# EAGLE board BlankMSXCartHSH (EAGLE 7.5.0), part 1 of 2
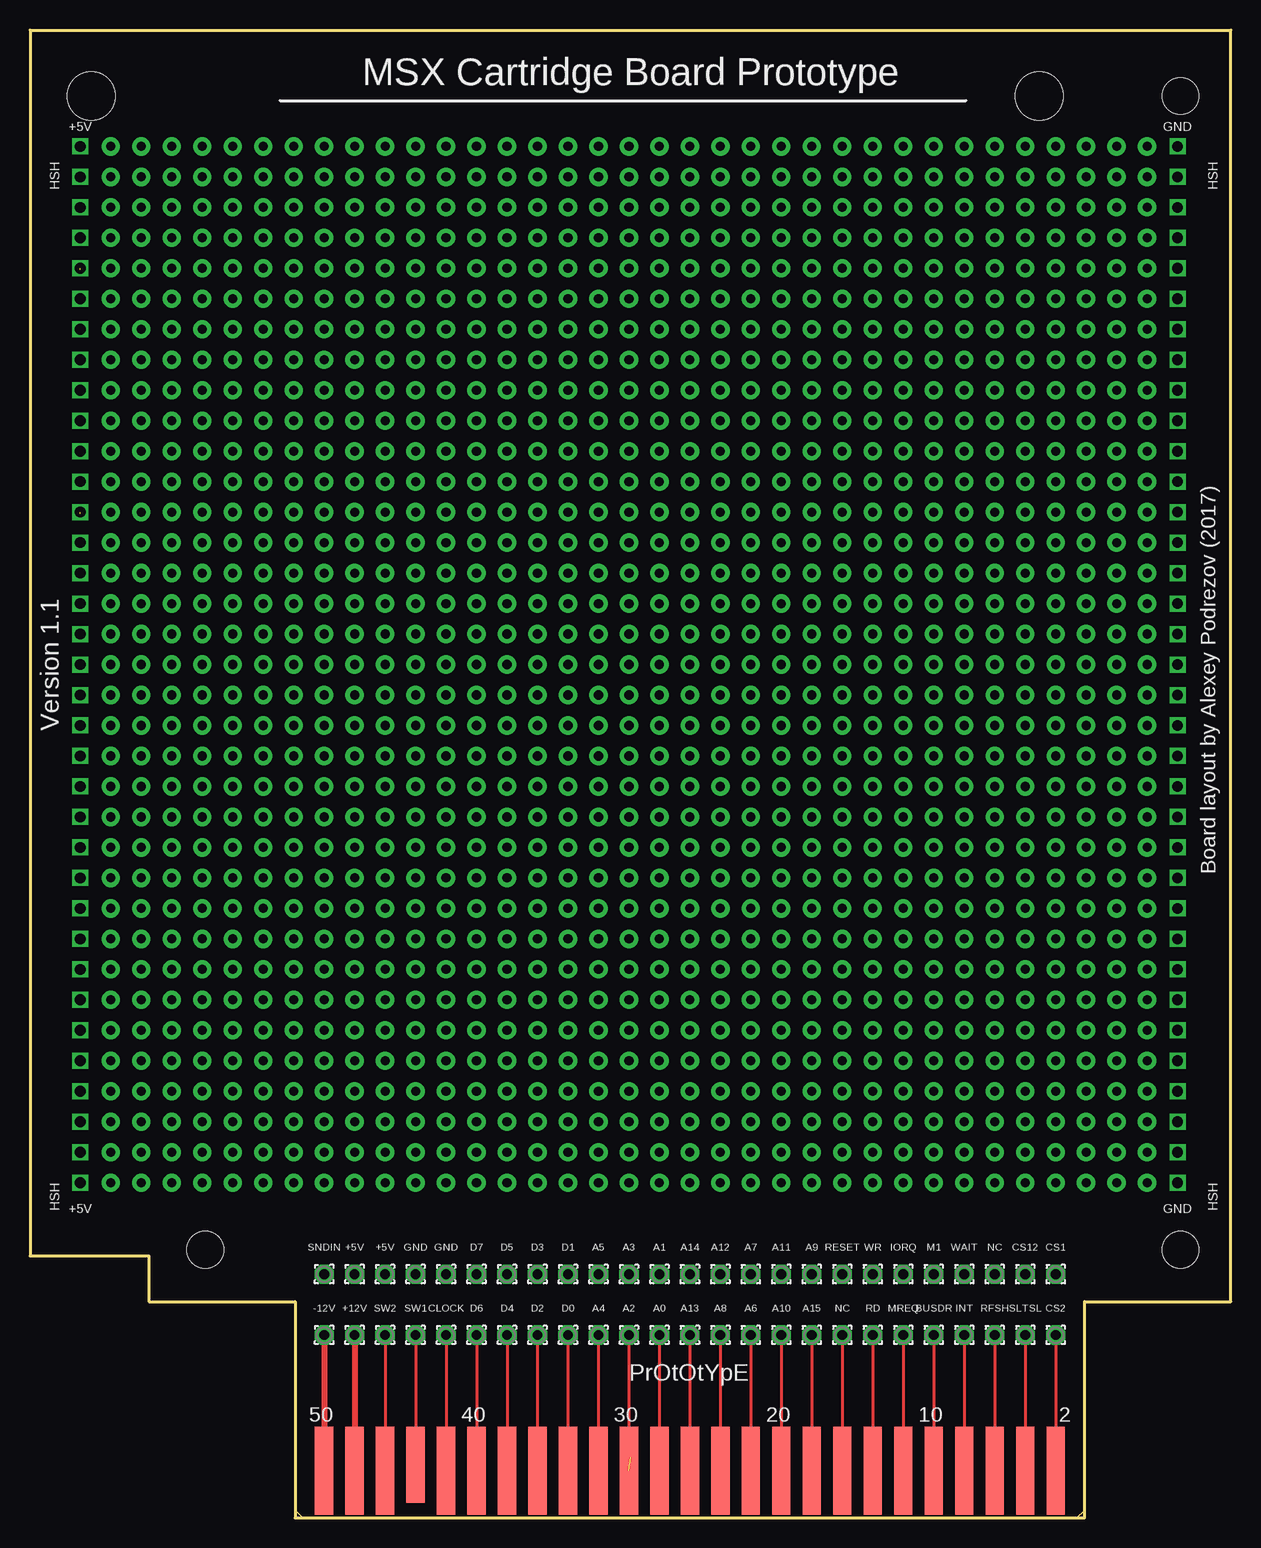
[diagram p1: board, top side]
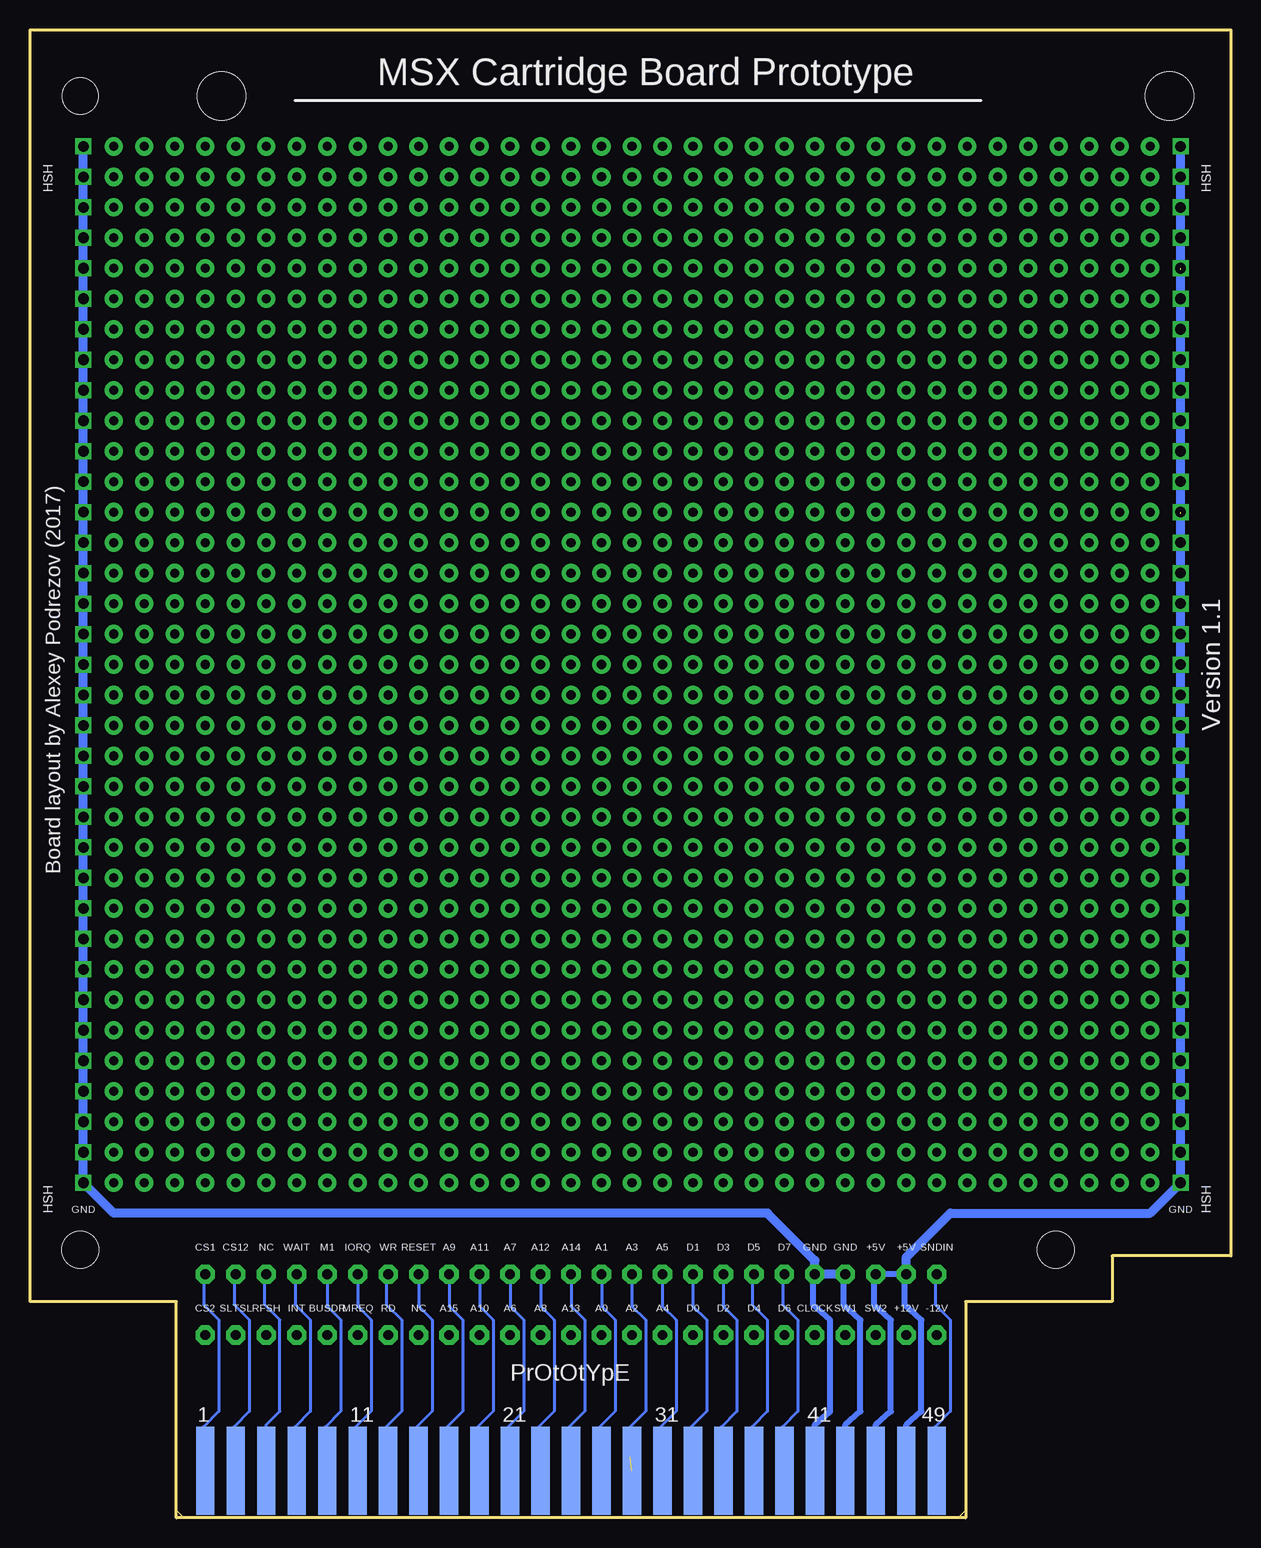
[diagram p2: board, bottom side, seen from below]

Size 100.08 x 124 mm. Coordinates in mm from the lower left corner, seen from the top.
Outline: 87.88,18.03 100.08,18.03 100.08,124 0,124 0,21.84 9.91,21.84 9.91,18.03 22.1,18.03
Outline: 22.1,18.03 22.1,12.95
Outline: 87.88,18.03 87.88,12.95
Outline: 22.1,18.03 22.1,0 87.88,0 87.88,18.03
Copper layers (1*16): Top 0.035mm / dielectric 1.5mm / Bottom 0.035mm
Design rules "default *": minimum track width 10mil, minimum drill 24mil, track to track 8mil, track to pad 8mil, pad to pad 8mil, via to via 8mil, smd to smd 8mil, copper to edge 10mil, drill to drill 8mil, minimum pad ring 10mil, minimum via ring 8mil, stop-mask expansion 4mil, vias tented up to drill 0mil, thermal gap 20mil
Holes 3.05 mm at 14.6,22.36 95.88,22.36
Holes 4 mm at 84.11,118.5 5.11,118.5
Holes 3 mm at 95.88,118.5

## Footprints (pad centres in the part's own frame; a part is rotated, then mirrored left to right if it is on the bottom)
MSXBUS_EDGECONN = smd 1.524 x 7.366 bottom: 1 30.48,3.937; 3 27.94,3.937; 5 25.4,3.937; 7 22.86,3.937; 9 20.32,3.937; 11 17.78,3.937; 13 15.24,3.937; 15 12.7,3.937; 17 10.16,3.937; 19 7.62,3.937; 21 5.08,3.937; 23 2.54,3.937; 25 0,3.937; 27 -2.54,3.937; 29 -5.08,3.937; 31 -7.62,3.937; 33 -10.16,3.937; 35 -12.7,3.937; 37 -15.24,3.937; 39 -17.78,3.937; 41 -20.32,3.937; 43 -22.86,3.937; 45 -25.4,3.937; 47 -27.94,3.937; 49 -30.48,3.937 | smd 1.524 x 7.366: 2 30.48,3.937; 4 27.94,3.937; 6 25.4,3.937; 8 22.86,3.937; 10 20.32,3.937; 12 17.78,3.937; 14 15.24,3.937; 16 12.7,3.937; 18 10.16,3.937; 20 7.62,3.937; 22 5.08,3.937; 24 2.54,3.937; 26 0,3.937; 28 -2.54,3.937; 30 -5.08,3.937; 32 -7.62,3.937; 34 -10.16,3.937; 36 -12.7,3.937; 38 -15.24,3.937; 40 -17.78,3.937; 42 -20.32,3.937; 46 -25.4,3.937; 48 -27.94,3.937; 50 -30.48,3.937 | smd 1.524 x 6.35: 44 -22.86,4.445
1,6/0,8 = drill 0.813 pad 1.6 octagon: 1 0,0

## Placement (x,y rotation side)
CN1  MSXBUS  [MSXBUS_EDGECONN]  54.99,0 0 top
PAD1  [1,6/0,8]  85.47,15.24 0 top
PAD2  [1,6/0,8]  82.93,15.24 0 top
PAD3  [1,6/0,8]  80.39,15.24 0 top
PAD4  [1,6/0,8]  77.85,15.24 0 top
PAD5  [1,6/0,8]  75.31,15.24 0 top
PAD6  [1,6/0,8]  72.77,15.24 0 top
PAD7  [1,6/0,8]  70.23,15.24 0 top
PAD8  [1,6/0,8]  67.69,15.24 0 top
PAD9  [1,6/0,8]  65.15,15.24 0 top
PAD10  [1,6/0,8]  62.61,15.24 0 top
PAD11  [1,6/0,8]  60.07,15.24 0 top
PAD12  [1,6/0,8]  57.53,15.24 0 top
PAD13  [1,6/0,8]  54.99,15.24 0 top
PAD14  [1,6/0,8]  52.45,15.24 0 top
PAD15  [1,6/0,8]  49.91,15.24 0 top
PAD16  [1,6/0,8]  47.37,15.24 0 top
PAD17  [1,6/0,8]  44.83,15.24 0 top
PAD18  [1,6/0,8]  42.29,15.24 0 top
PAD19  [1,6/0,8]  39.75,15.24 0 top
PAD20  [1,6/0,8]  37.21,15.24 0 top
PAD21  [1,6/0,8]  34.67,15.24 0 top
PAD22  [1,6/0,8]  32.13,15.24 0 top
PAD23  [1,6/0,8]  29.59,15.24 0 top
PAD24  [1,6/0,8]  27.05,15.24 0 top
PAD25  [1,6/0,8]  24.51,15.24 0 top
PAD26  [1,6/0,8]  85.47,20.32 0 top
PAD27  [1,6/0,8]  82.93,20.32 0 top
PAD28  [1,6/0,8]  32.13,20.32 0 top
PAD29  [1,6/0,8]  77.85,20.32 0 top
PAD30  [1,6/0,8]  75.31,20.32 0 top
PAD31  [1,6/0,8]  72.77,20.32 0 top
PAD32  [1,6/0,8]  24.51,20.32 0 top
PAD33  [1,6/0,8]  27.05,20.32 0 top
PAD34  [1,6/0,8]  29.59,20.32 0 top
PAD35  [1,6/0,8]  34.67,20.32 0 top
PAD36  [1,6/0,8]  80.39,20.32 0 top
PAD37  [1,6/0,8]  37.21,20.32 0 top
PAD38  [1,6/0,8]  39.75,20.32 0 top
PAD39  [1,6/0,8]  42.29,20.32 0 top
PAD40  [1,6/0,8]  44.83,20.32 0 top
PAD41  [1,6/0,8]  47.37,20.32 0 top
PAD42  [1,6/0,8]  49.91,20.32 0 top
PAD43  [1,6/0,8]  52.45,20.32 0 top
PAD44  [1,6/0,8]  54.99,20.32 0 top
PAD45  [1,6/0,8]  57.53,20.32 0 top
PAD46  [1,6/0,8]  60.07,20.32 0 top
PAD47  [1,6/0,8]  62.61,20.32 0 top
PAD48  [1,6/0,8]  65.15,20.32 0 top
PAD49  [1,6/0,8]  67.69,20.32 0 top
PAD50  [1,6/0,8]  70.23,20.32 0 top

## Tracks (layer width: path | path; a pad name or v marks a point on that pad's centre or on a via)
+5V  (via drill 0.89)  (2 unrouted)
  Bottom 0.508: CN1.47 27.05,7.76 25.79,8.89 25.79,16.51 27.19,17.78 27.19,20.18 | 27.19,20.18 PAD33.1 | CN1.45 29.59,7.76 28.33,8.89 28.33,16.51 29.73,17.78 29.73,20.18 PAD34.1 27.19,20.32 27.19,20.18
  Bottom 0.762: PAD33.1 27.05,21.73 23.38,25.4 6.73,25.4 v4.19,27.94 v4.19,30.48 v4.19,33.02 v4.19,35.56 v4.19,38.1 v4.19,40.64 v4.19,43.18 v4.19,45.72 v4.19,48.26 4.19,50.66 4.33,50.8 v4.19,50.8 v4.19,53.34 v4.19,55.88 v4.19,58.42 v4.19,60.96 v4.19,63.5 v4.19,66.04 v4.19,68.58 v4.19,71.12 v4.19,73.66 v4.19,76.2 v4.19,78.74 v4.19,81.28 4.19,83.68 4.33,83.82 | v4.19,83.82 v4.19,86.36 v4.19,88.9 v4.19,91.44 v4.19,93.98 v4.19,96.52 v4.19,99.06 4.19,101.46 4.33,101.6 v4.19,101.6 4.19,104 4.33,104.14 | v4.19,104.14 v4.19,106.68 v4.19,109.22 v4.19,111.76 v4.19,114.3
GND  (via drill 0.89)
  Bottom 0.254: CN1.41 34.68,3.94 34.81,3.81
  Bottom 0.508: CN1.43 32.13,7.76 30.87,8.89 30.87,16.51 32.27,17.78 32.27,20.18 PAD28.1 | CN1.41 34.67,7.76 33.4,8.89 33.4,16.51 34.81,17.78 34.81,20.18 PAD35.1
  Bottom 0.762: PAD28.1 PAD35.1 34.67,21.45 38.62,25.4 93.09,25.4 v95.63,27.94 v95.63,30.48 v95.63,33.02 v95.63,35.56 v95.63,38.1 v95.63,40.64 v95.63,43.18 v95.63,45.72 v95.63,48.26 v95.63,50.8 v95.63,53.34 v95.63,55.88 v95.63,58.42 v95.63,60.96 v95.63,63.5 v95.63,66.04 v95.63,68.58 v95.63,71.12 v95.63,73.66 v95.63,76.2 v95.63,78.74 v95.63,81.28 v95.63,83.82 v95.63,86.36 v95.63,88.9 v95.63,91.44 v95.63,93.98 v95.63,96.52 v95.63,99.06 v95.63,101.6 v95.63,104.14 v95.63,106.68 v95.63,109.22 v95.63,111.76 v95.63,114.3
HOLE1  (via drill 0.76 pad 1.52)
  other vias: 29.59,88.9
HOLE2  (via drill 0.76 pad 1.52)
  other vias: 19.43,88.9
HOLE3  (via drill 0.76 pad 1.52)
  other vias: 29.59,91.44
HOLE4  (via drill 0.76 pad 1.52)
  other vias: 29.59,27.94
HOLE5  (via drill 0.76 pad 1.52)
  other vias: 19.43,27.94
HOLE6  (via drill 0.76 pad 1.52)
  other vias: 29.59,30.48
HOLE7  (via drill 0.76 pad 1.52)
  other vias: 19.43,30.48
HOLE8  (via drill 0.76 pad 1.52)
  other vias: 29.59,33.02
HOLE9  (via drill 0.76 pad 1.52)
  other vias: 19.43,33.02
HOLE10  (via drill 0.76 pad 1.52)
  other vias: 29.59,35.56
HOLE11  (via drill 0.76 pad 1.52)
  other vias: 19.43,35.56
HOLE12  (via drill 0.76 pad 1.52)
  other vias: 29.59,38.1
HOLE13  (via drill 0.76 pad 1.52)
  other vias: 19.43,38.1
HOLE14  (via drill 0.76 pad 1.52)
  other vias: 29.59,40.64
HOLE15  (via drill 0.76 pad 1.52)
  other vias: 19.43,40.64
HOLE16  (via drill 0.76 pad 1.52)
  other vias: 29.59,43.18
HOLE17  (via drill 0.76 pad 1.52)
  other vias: 19.43,43.18
HOLE18  (via drill 0.76 pad 1.52)
  other vias: 29.59,45.72
HOLE19  (via drill 0.76 pad 1.52)
  other vias: 19.43,45.72
HOLE20  (via drill 0.76 pad 1.52)
  other vias: 29.59,48.26
HOLE21  (via drill 0.76 pad 1.52)
  other vias: 19.43,48.26
HOLE22  (via drill 0.76 pad 1.52)
  other vias: 29.59,50.8
HOLE23  (via drill 0.76 pad 1.52)
  other vias: 19.43,50.8
HOLE24  (via drill 0.76 pad 1.52)
  other vias: 29.59,53.34
HOLE25  (via drill 0.76 pad 1.52)
  other vias: 19.43,53.34
HOLE26  (via drill 0.76 pad 1.52)
  other vias: 29.59,55.88
HOLE27  (via drill 0.76 pad 1.52)
  other vias: 19.43,55.88
HOLE28  (via drill 0.76 pad 1.52)
  other vias: 29.59,58.42
HOLE29  (via drill 0.76 pad 1.52)
  other vias: 19.43,58.42
HOLE30  (via drill 0.76 pad 1.52)
  other vias: 29.59,60.96
HOLE31  (via drill 0.76 pad 1.52)
  other vias: 19.43,60.96
HOLE32  (via drill 0.76 pad 1.52)
  other vias: 29.59,63.5
HOLE33  (via drill 0.76 pad 1.52)
  other vias: 19.43,63.5
HOLE34  (via drill 0.76 pad 1.52)
  other vias: 29.59,66.04
HOLE35  (via drill 0.76 pad 1.52)
  other vias: 19.43,66.04
HOLE36  (via drill 0.76 pad 1.52)
  other vias: 29.59,68.58
HOLE37  (via drill 0.76 pad 1.52)
  other vias: 19.43,68.58
HOLE38  (via drill 0.76 pad 1.52)
  other vias: 29.59,71.12
HOLE39  (via drill 0.76 pad 1.52)
  other vias: 19.43,71.12
HOLE40  (via drill 0.76 pad 1.52)
  other vias: 29.59,73.66
HOLE41  (via drill 0.76 pad 1.52)
  other vias: 19.43,73.66
HOLE42  (via drill 0.76 pad 1.52)
  other vias: 29.59,76.2
HOLE43  (via drill 0.76 pad 1.52)
  other vias: 19.43,76.2
HOLE44  (via drill 0.76 pad 1.52)
  other vias: 29.59,78.74
HOLE45  (via drill 0.76 pad 1.52)
  other vias: 19.43,78.74
HOLE46  (via drill 0.76 pad 1.52)
  other vias: 29.59,81.28
HOLE47  (via drill 0.76 pad 1.52)
  other vias: 19.43,81.28
HOLE48  (via drill 0.76 pad 1.52)
  other vias: 29.59,83.82
HOLE49  (via drill 0.76 pad 1.52)
  other vias: 19.43,83.82
HOLE50  (via drill 0.76 pad 1.52)
  other vias: 29.59,86.36
HOLE51  (via drill 0.76 pad 1.52)
  other vias: 19.43,86.36
HOLE52  (via drill 0.76 pad 1.52)
  other vias: 19.43,91.44
HOLE53  (via drill 0.76 pad 1.52)
  other vias: 29.59,93.98
HOLE54  (via drill 0.76 pad 1.52)
  other vias: 19.43,93.98
HOLE55  (via drill 0.76 pad 1.52)
  other vias: 29.59,96.52
HOLE56  (via drill 0.76 pad 1.52)
  other vias: 19.43,96.52
HOLE57  (via drill 0.76 pad 1.52)
  other vias: 29.59,99.06
HOLE58  (via drill 0.76 pad 1.52)
  other vias: 19.43,99.06
HOLE59  (via drill 0.76 pad 1.52)
  other vias: 29.59,101.6
HOLE60  (via drill 0.76 pad 1.52)
  other vias: 19.43,101.6
HOLE61  (via drill 0.76 pad 1.52)
  other vias: 29.59,104.14
HOLE62  (via drill 0.76 pad 1.52)
  other vias: 19.43,104.14
HOLE63  (via drill 0.76 pad 1.52)
  other vias: 29.59,106.68
HOLE64  (via drill 0.76 pad 1.52)
  other vias: 19.43,106.68
HOLE65  (via drill 0.76 pad 1.52)
  other vias: 29.59,109.22
HOLE66  (via drill 0.76 pad 1.52)
  other vias: 19.43,109.22
HOLE67  (via drill 0.76 pad 1.52)
  other vias: 29.59,111.76
HOLE68  (via drill 0.76 pad 1.52)
  other vias: 19.43,111.76
HOLE69  (via drill 0.76 pad 1.52)
  other vias: 29.59,114.3
HOLE70  (via drill 0.76 pad 1.52)
  other vias: 19.43,114.3
N$1
  Top 0.254: PAD1.1 CN1.2
N$2
  Top 0.254: PAD2.1 CN1.4
N$4
  Top 0.254: PAD3.1 CN1.6
N$5  (via drill 0.76 pad 1.52)
  other vias: 34.67,88.9
N$6
  Top 0.254: PAD4.1 CN1.8
N$7
  Top 0.254: PAD5.1 CN1.10
N$8
  Top 0.254: PAD6.1 CN1.12
N$9
  Top 0.254: PAD7.1 CN1.14
N$10
  Top 0.254: PAD8.1 CN1.16
N$11
  Top 0.254: PAD9.1 CN1.18
N$12
  Top 0.254: PAD10.1 CN1.20
N$13
  Top 0.254: PAD11.1 CN1.22
N$14
  Top 0.254: PAD12.1 CN1.24
N$15
  Top 0.254: PAD13.1 CN1.26
N$16
  Top 0.254: PAD14.1 CN1.28
N$17  (1 unrouted)
  Top 0.254: PAD15.1 49.91,5.22 50.05,5.08
N$18
  Top 0.254: PAD16.1 CN1.32
N$19
  Top 0.254: PAD17.1 CN1.34
N$20
  Top 0.254: PAD18.1 CN1.36
N$21
  Top 0.254: PAD19.1 CN1.38
N$22
  Top 0.254: PAD20.1 CN1.40
N$23
  Top 0.254: PAD21.1 CN1.42
N$24
  Top 0.254: PAD22.1 CN1.44
N$25
  Top 0.254: PAD23.1 CN1.46
N$26
  Top 0.508: PAD24.1 CN1.48
N$27
  Top 0.508: PAD25.1 CN1.50
N$28
  Bottom 0.254: PAD26.1 85.61,20.32 85.61,17.78 84.34,16.51 84.34,8.89 85.61,7.62 85.61,4.08 CN1.1
N$29
  Bottom 0.254: PAD27.1 83.07,20.32 83.07,17.78 81.8,16.51 81.8,8.89 83.07,7.62 83.07,4.08 CN1.3
N$30
  Bottom 0.254: CN1.5 80.39,7.76 79.26,8.89 79.26,16.51 80.53,17.78 80.53,20.18 PAD36.1
N$31
  Bottom 0.254: PAD29.1 77.99,20.32 77.99,17.78 76.72,16.51 76.72,8.89 77.99,7.62 77.99,4.08 CN1.7
N$32
  Bottom 0.254: PAD30.1 75.31,17.64 74.18,16.51 74.18,8.89 75.45,7.62 75.45,4.08 CN1.9
N$33
  Bottom 0.254: PAD31.1 72.77,17.64 71.64,16.51 71.64,8.89 72.91,7.62 72.91,4.08 CN1.11
N$34
  Bottom 0.254: PAD32.1 24.65,20.32 24.65,17.78 23.38,16.51 23.38,8.89 24.65,7.62 24.65,4.08 CN1.49
N$37  (via drill 0.76 pad 1.52)
  other vias: 32.13,88.9
N$38  (via drill 0.76 pad 1.52)
  other vias: 39.75,88.9
N$39
  Bottom 0.254: PAD37.1 37.35,20.32 37.35,17.78 36.08,16.51 36.08,8.89 37.35,7.62 37.35,4.08 CN1.39
N$40
  Bottom 0.254: PAD38.1 39.89,20.32 39.89,17.78 38.62,16.51 38.62,8.89 39.89,7.62 39.89,4.08 CN1.37
N$41
  Bottom 0.254: PAD39.1 42.29,17.64 41.16,16.51 41.16,8.89 42.43,7.62 42.43,4.08 CN1.35
N$42
  Bottom 0.254: PAD40.1 44.83,17.64 43.7,16.51 43.7,8.89 44.97,7.62 44.97,4.08 CN1.33
N$43
  Bottom 0.254: PAD41.1 47.37,17.64 46.24,16.51 46.24,8.89 47.51,7.62 47.51,4.08 CN1.31
N$44
  Bottom 0.254: PAD42.1 49.91,17.64 48.78,16.51 48.78,8.89 50.05,7.62 50.05,4.08 CN1.29
N$45
  Bottom 0.254: PAD43.1 52.45,17.64 51.32,16.51 51.32,8.89 52.59,7.62 52.59,4.08 CN1.27
N$46
  Bottom 0.254: PAD44.1 54.99,17.64 53.86,16.51 53.86,8.89 55.13,7.62 55.13,4.08 CN1.25
N$47
  Bottom 0.254: PAD45.1 57.53,17.64 56.4,16.51 56.4,8.89 57.67,7.62 57.67,4.08 CN1.23
N$48
  Bottom 0.254: PAD46.1 60.07,17.64 58.94,16.51 58.94,8.89 60.21,7.62 60.21,4.08 CN1.21
N$49
  Bottom 0.254: PAD47.1 62.61,17.64 61.48,16.51 61.48,8.89 62.75,7.62 62.75,4.08 CN1.19
N$50  (via drill 0.76 pad 1.52)
  other vias: 37.21,88.9
N$51  (via drill 0.76 pad 1.52)
  other vias: 44.83,88.9
N$52  (via drill 0.76 pad 1.52)
  other vias: 42.29,88.9
N$53  (via drill 0.76 pad 1.52)
  other vias: 49.91,88.9
N$54  (via drill 0.76 pad 1.52)
  other vias: 47.37,88.9
N$55  (via drill 0.76 pad 1.52)
  other vias: 54.99,88.9
N$56  (via drill 0.76 pad 1.52)
  other vias: 52.45,88.9
N$57  (via drill 0.76 pad 1.52)
  other vias: 60.07,88.9
N$58  (via drill 0.76 pad 1.52)
  other vias: 57.53,88.9
N$59  (via drill 0.76 pad 1.52)
  other vias: 65.15,88.9
N$60  (via drill 0.76 pad 1.52)
  other vias: 62.61,88.9
N$61  (via drill 0.76 pad 1.52)
  other vias: 70.23,88.9
N$62  (via drill 0.76 pad 1.52)
  other vias: 67.69,88.9
N$63  (via drill 0.76 pad 1.52)
  other vias: 75.31,88.9
N$64  (via drill 0.76 pad 1.52)
  other vias: 72.77,88.9
N$65  (via drill 0.76 pad 1.52)
  other vias: 80.39,88.9
N$66  (via drill 0.76 pad 1.52)
  other vias: 77.85,88.9
N$67  (via drill 0.76 pad 1.52)
  other vias: 85.47,88.9
N$68  (via drill 0.76 pad 1.52)
  other vias: 82.93,88.9
N$69  (via drill 0.76 pad 1.52)
  other vias: 90.55,88.9
N$70  (via drill 0.76 pad 1.52)
  other vias: 93.09,88.9
N$71  (via drill 0.76 pad 1.52)
  other vias: 88.01,88.9
N$72  (via drill 0.76 pad 1.52)
  other vias: 21.97,88.9
N$73  (via drill 0.76 pad 1.52)
  other vias: 24.51,88.9
N$74  (via drill 0.76 pad 1.52)
  other vias: 27.05,88.9
N$75  (via drill 0.76 pad 1.52)
  other vias: 6.73,88.9
N$76  (via drill 0.76 pad 1.52)
  other vias: 9.27,88.9
N$77  (via drill 0.76 pad 1.52)
  other vias: 11.81,88.9
N$78  (via drill 0.76 pad 1.52)
  other vias: 14.35,88.9
N$79  (via drill 0.76 pad 1.52)
  other vias: 16.89,88.9
N$80  (via drill 0.76 pad 1.52)
  other vias: 34.67,91.44
N$81  (via drill 0.76 pad 1.52)
  other vias: 32.13,91.44
N$82  (via drill 0.76 pad 1.52)
  other vias: 39.75,91.44
N$83  (via drill 0.76 pad 1.52)
  other vias: 37.21,91.44
N$84  (via drill 0.76 pad 1.52)
  other vias: 44.83,91.44
N$85  (via drill 0.76 pad 1.52)
  other vias: 42.29,91.44
N$86  (via drill 0.76 pad 1.52)
  other vias: 49.91,91.44
N$87  (via drill 0.76 pad 1.52)
  other vias: 47.37,91.44
N$88  (via drill 0.76 pad 1.52)
  other vias: 54.99,91.44
N$89  (via drill 0.76 pad 1.52)
  other vias: 52.45,91.44
N$90  (via drill 0.76 pad 1.52)
  other vias: 60.07,91.44
N$91  (via drill 0.76 pad 1.52)
  other vias: 57.53,91.44
N$92  (via drill 0.76 pad 1.52)
  other vias: 65.15,91.44
N$93  (via drill 0.76 pad 1.52)
  other vias: 62.61,91.44
N$94  (via drill 0.76 pad 1.52)
  other vias: 70.23,91.44
N$95  (via drill 0.76 pad 1.52)
  other vias: 67.69,91.44
N$96  (via drill 0.76 pad 1.52)
  other vias: 75.31,91.44
N$97  (via drill 0.76 pad 1.52)
  other vias: 72.77,91.44
N$98  (via drill 0.76 pad 1.52)
  other vias: 80.39,91.44
N$99  (via drill 0.76 pad 1.52)
  other vias: 77.85,91.44
N$100  (via drill 0.76 pad 1.52)
  other vias: 85.47,91.44
N$101  (via drill 0.76 pad 1.52)
  other vias: 82.93,91.44
N$102  (via drill 0.76 pad 1.52)
  other vias: 90.55,91.44
N$103  (via drill 0.76 pad 1.52)
  other vias: 93.09,91.44
N$104  (via drill 0.76 pad 1.52)
  other vias: 88.01,91.44
N$105  (via drill 0.76 pad 1.52)
  other vias: 21.97,91.44
N$106  (via drill 0.76 pad 1.52)
  other vias: 24.51,91.44
N$107  (via drill 0.76 pad 1.52)
  other vias: 27.05,91.44
N$108  (via drill 0.76 pad 1.52)
  other vias: 6.73,91.44
N$109  (via drill 0.76 pad 1.52)
  other vias: 9.27,91.44
N$110  (via drill 0.76 pad 1.52)
  other vias: 11.81,91.44
N$111  (via drill 0.76 pad 1.52)
  other vias: 14.35,91.44
N$112  (via drill 0.76 pad 1.52)
  other vias: 16.89,91.44
N$113  (via drill 0.76 pad 1.52)
  other vias: 34.67,93.98
N$114  (via drill 0.76 pad 1.52)
  other vias: 32.13,93.98
N$115  (via drill 0.76 pad 1.52)
  other vias: 39.75,93.98
N$116  (via drill 0.76 pad 1.52)
  other vias: 37.21,93.98
N$117  (via drill 0.76 pad 1.52)
  other vias: 44.83,93.98
N$118  (via drill 0.76 pad 1.52)
  other vias: 42.29,93.98
N$119  (via drill 0.76 pad 1.52)
  other vias: 49.91,93.98
N$120  (via drill 0.76 pad 1.52)
  other vias: 47.37,93.98
N$121  (via drill 0.76 pad 1.52)
  other vias: 54.99,93.98
N$122  (via drill 0.76 pad 1.52)
  other vias: 52.45,93.98
N$123  (via drill 0.76 pad 1.52)
  other vias: 60.07,93.98
N$124  (via drill 0.76 pad 1.52)
  other vias: 57.53,93.98
N$125  (via drill 0.76 pad 1.52)
  other vias: 65.15,93.98
N$126  (via drill 0.76 pad 1.52)
  other vias: 62.61,93.98
N$127  (via drill 0.76 pad 1.52)
  other vias: 70.23,93.98
N$128  (via drill 0.76 pad 1.52)
  other vias: 67.69,93.98
N$129  (via drill 0.76 pad 1.52)
  other vias: 75.31,93.98
N$130  (via drill 0.76 pad 1.52)
  other vias: 72.77,93.98
N$131  (via drill 0.76 pad 1.52)
  other vias: 80.39,93.98
N$132  (via drill 0.76 pad 1.52)
  other vias: 77.85,93.98
N$133  (via drill 0.76 pad 1.52)
  other vias: 85.47,93.98
N$134  (via drill 0.76 pad 1.52)
  other vias: 82.93,93.98
N$135  (via drill 0.76 pad 1.52)
  other vias: 90.55,93.98
N$136  (via drill 0.76 pad 1.52)
  other vias: 34.67,27.94
N$137  (via drill 0.76 pad 1.52)
  other vias: 32.13,27.94
N$138  (via drill 0.76 pad 1.52)
  other vias: 39.75,27.94
N$139  (via drill 0.76 pad 1.52)
  other vias: 37.21,27.94
N$140  (via drill 0.76 pad 1.52)
  other vias: 44.83,27.94
N$141  (via drill 0.76 pad 1.52)
  other vias: 42.29,27.94
N$142  (via drill 0.76 pad 1.52)
  other vias: 49.91,27.94
N$143  (via drill 0.76 pad 1.52)
  other vias: 47.37,27.94
N$144  (via drill 0.76 pad 1.52)
  other vias: 54.99,27.94
N$145  (via drill 0.76 pad 1.52)
  other vias: 52.45,27.94
N$146  (via drill 0.76 pad 1.52)
  other vias: 60.07,27.94
N$147  (via drill 0.76 pad 1.52)
  other vias: 57.53,27.94
N$148  (via drill 0.76 pad 1.52)
  other vias: 65.15,27.94
N$149  (via drill 0.76 pad 1.52)
  other vias: 62.61,27.94
N$150  (via drill 0.76 pad 1.52)
  other vias: 70.23,27.94
N$151  (via drill 0.76 pad 1.52)
  other vias: 67.69,27.94
N$152  (via drill 0.76 pad 1.52)
  other vias: 75.31,27.94
N$153  (via drill 0.76 pad 1.52)
  other vias: 72.77,27.94
N$154  (via drill 0.76 pad 1.52)
  other vias: 80.39,27.94
N$155  (via drill 0.76 pad 1.52)
  other vias: 77.85,27.94
N$156  (via drill 0.76 pad 1.52)
  other vias: 85.47,27.94
N$157  (via drill 0.76 pad 1.52)
  other vias: 82.93,27.94
N$158  (via drill 0.76 pad 1.52)
  other vias: 90.55,27.94
N$159  (via drill 0.76 pad 1.52)
  other vias: 93.09,27.94
N$160  (via drill 0.76 pad 1.52)
  other vias: 88.01,27.94
N$161  (via drill 0.76 pad 1.52)
  other vias: 21.97,27.94
N$162  (via drill 0.76 pad 1.52)
  other vias: 24.51,27.94
N$163  (via drill 0.76 pad 1.52)
  other vias: 27.05,27.94
N$164  (via drill 0.76 pad 1.52)
  other vias: 6.73,27.94
N$165  (via drill 0.76 pad 1.52)
  other vias: 9.27,27.94
N$166  (via drill 0.76 pad 1.52)
  other vias: 11.81,27.94
N$167  (via drill 0.76 pad 1.52)
  other vias: 14.35,27.94
N$168  (via drill 0.76 pad 1.52)
  other vias: 16.89,27.94
N$169  (via drill 0.76 pad 1.52)
  other vias: 34.67,30.48
N$170  (via drill 0.76 pad 1.52)
  other vias: 32.13,30.48
N$171  (via drill 0.76 pad 1.52)
  other vias: 39.75,30.48
N$172  (via drill 0.76 pad 1.52)
  other vias: 37.21,30.48
N$173  (via drill 0.76 pad 1.52)
  other vias: 44.83,30.48
N$174  (via drill 0.76 pad 1.52)
  other vias: 42.29,30.48
N$175  (via drill 0.76 pad 1.52)
  other vias: 49.91,30.48
N$176  (via drill 0.76 pad 1.52)
  other vias: 47.37,30.48
N$177  (via drill 0.76 pad 1.52)
  other vias: 54.99,30.48
N$178  (via drill 0.76 pad 1.52)
  other vias: 52.45,30.48
N$179  (via drill 0.76 pad 1.52)
  other vias: 60.07,30.48
N$180  (via drill 0.76 pad 1.52)
  other vias: 57.53,30.48
N$181  (via drill 0.76 pad 1.52)
  other vias: 65.15,30.48
N$182  (via drill 0.76 pad 1.52)
  other vias: 62.61,30.48
N$183  (via drill 0.76 pad 1.52)
  other vias: 70.23,30.48
N$184  (via drill 0.76 pad 1.52)
  other vias: 67.69,30.48
N$185  (via drill 0.76 pad 1.52)
  other vias: 75.31,30.48
N$186  (via drill 0.76 pad 1.52)
  other vias: 72.77,30.48
N$187  (via drill 0.76 pad 1.52)
  other vias: 80.39,30.48
N$188  (via drill 0.76 pad 1.52)
  other vias: 77.85,30.48
N$189  (via drill 0.76 pad 1.52)
  other vias: 85.47,30.48
N$190  (via drill 0.76 pad 1.52)
  other vias: 82.93,30.48
N$191  (via drill 0.76 pad 1.52)
  other vias: 90.55,30.48
N$192  (via drill 0.76 pad 1.52)
  other vias: 93.09,30.48
N$193  (via drill 0.76 pad 1.52)
  other vias: 88.01,30.48
N$194  (via drill 0.76 pad 1.52)
  other vias: 21.97,30.48
N$195  (via drill 0.76 pad 1.52)
  other vias: 24.51,30.48
N$196  (via drill 0.76 pad 1.52)
  other vias: 27.05,30.48
N$197  (via drill 0.76 pad 1.52)
  other vias: 6.73,30.48
N$198  (via drill 0.76 pad 1.52)
  other vias: 9.27,30.48
N$199  (via drill 0.76 pad 1.52)
  other vias: 11.81,30.48
N$200  (via drill 0.76 pad 1.52)
  other vias: 14.35,30.48
N$201  (via drill 0.76 pad 1.52)
  other vias: 16.89,30.48
N$202  (via drill 0.76 pad 1.52)
  other vias: 34.67,33.02
N$203  (via drill 0.76 pad 1.52)
  other vias: 32.13,33.02
N$204  (via drill 0.76 pad 1.52)
  other vias: 39.75,33.02
N$205  (via drill 0.76 pad 1.52)
  other vias: 37.21,33.02
N$206  (via drill 0.76 pad 1.52)
  other vias: 44.83,33.02
N$207  (via drill 0.76 pad 1.52)
  other vias: 42.29,33.02
N$208  (via drill 0.76 pad 1.52)
  other vias: 49.91,33.02
N$209  (via drill 0.76 pad 1.52)
  other vias: 47.37,33.02
N$210  (via drill 0.76 pad 1.52)
  other vias: 54.99,33.02
N$211  (via drill 0.76 pad 1.52)
  other vias: 52.45,33.02
N$212  (via drill 0.76 pad 1.52)
  other vias: 60.07,33.02
N$213  (via drill 0.76 pad 1.52)
  other vias: 57.53,33.02
N$214  (via drill 0.76 pad 1.52)
  other vias: 65.15,33.02
N$215  (via drill 0.76 pad 1.52)
  other vias: 62.61,33.02
N$216  (via drill 0.76 pad 1.52)
  other vias: 70.23,33.02
N$217  (via drill 0.76 pad 1.52)
  other vias: 67.69,33.02
N$218  (via drill 0.76 pad 1.52)
  other vias: 75.31,33.02
N$219  (via drill 0.76 pad 1.52)
  other vias: 72.77,33.02
N$220  (via drill 0.76 pad 1.52)
  other vias: 80.39,33.02
N$221  (via drill 0.76 pad 1.52)
  other vias: 77.85,33.02
N$222  (via drill 0.76 pad 1.52)
  other vias: 85.47,33.02
N$223  (via drill 0.76 pad 1.52)
  other vias: 82.93,33.02
N$224  (via drill 0.76 pad 1.52)
  other vias: 90.55,33.02
N$225  (via drill 0.76 pad 1.52)
  other vias: 93.09,33.02
N$226  (via drill 0.76 pad 1.52)
  other vias: 88.01,33.02
N$227  (via drill 0.76 pad 1.52)
  other vias: 21.97,33.02
N$228  (via drill 0.76 pad 1.52)
  other vias: 24.51,33.02
N$229  (via drill 0.76 pad 1.52)
  other vias: 27.05,33.02
N$230  (via drill 0.76 pad 1.52)
  other vias: 6.73,33.02
N$231  (via drill 0.76 pad 1.52)
  other vias: 9.27,33.02
N$232  (via drill 0.76 pad 1.52)
  other vias: 11.81,33.02
N$233  (via drill 0.76 pad 1.52)
  other vias: 14.35,33.02
N$234  (via drill 0.76 pad 1.52)
  other vias: 16.89,33.02
N$235  (via drill 0.76 pad 1.52)
  other vias: 34.67,35.56
N$236  (via drill 0.76 pad 1.52)
  other vias: 32.13,35.56
N$237  (via drill 0.76 pad 1.52)
  other vias: 39.75,35.56
N$238  (via drill 0.76 pad 1.52)
  other vias: 37.21,35.56
N$239  (via drill 0.76 pad 1.52)
  other vias: 44.83,35.56
N$240  (via drill 0.76 pad 1.52)
  other vias: 42.29,35.56
N$241  (via drill 0.76 pad 1.52)
  other vias: 49.91,35.56
N$242  (via drill 0.76 pad 1.52)
  other vias: 47.37,35.56
N$243  (via drill 0.76 pad 1.52)
  other vias: 54.99,35.56
N$244  (via drill 0.76 pad 1.52)
  other vias: 52.45,35.56
N$245  (via drill 0.76 pad 1.52)
  other vias: 60.07,35.56
N$246  (via drill 0.76 pad 1.52)
  other vias: 57.53,35.56
N$247  (via drill 0.76 pad 1.52)
  other vias: 65.15,35.56
N$248  (via drill 0.76 pad 1.52)
  other vias: 62.61,35.56
N$249  (via drill 0.76 pad 1.52)
  other vias: 70.23,35.56
N$250  (via drill 0.76 pad 1.52)
  other vias: 67.69,35.56
N$251  (via drill 0.76 pad 1.52)
  other vias: 75.31,35.56
N$252  (via drill 0.76 pad 1.52)
  other vias: 72.77,35.56
N$253  (via drill 0.76 pad 1.52)
  other vias: 80.39,35.56
N$254  (via drill 0.76 pad 1.52)
  other vias: 77.85,35.56
N$255  (via drill 0.76 pad 1.52)
  other vias: 85.47,35.56
N$256  (via drill 0.76 pad 1.52)
  other vias: 82.93,35.56
N$257  (via drill 0.76 pad 1.52)
  other vias: 90.55,35.56
N$258  (via drill 0.76 pad 1.52)
  other vias: 93.09,35.56
N$259  (via drill 0.76 pad 1.52)
  other vias: 88.01,35.56
N$260  (via drill 0.76 pad 1.52)
  other vias: 21.97,35.56
N$261  (via drill 0.76 pad 1.52)
  other vias: 24.51,35.56
N$262  (via drill 0.76 pad 1.52)
  other vias: 27.05,35.56
N$263  (via drill 0.76 pad 1.52)
  other vias: 6.73,35.56
N$264  (via drill 0.76 pad 1.52)
  other vias: 9.27,35.56
N$265  (via drill 0.76 pad 1.52)
  other vias: 11.81,35.56
N$266  (via drill 0.76 pad 1.52)
  other vias: 14.35,35.56
N$267  (via drill 0.76 pad 1.52)
  other vias: 16.89,35.56
N$268  (via drill 0.76 pad 1.52)
  other vias: 34.67,38.1
N$269  (via drill 0.76 pad 1.52)
  other vias: 32.13,38.1
N$270  (via drill 0.76 pad 1.52)
  other vias: 39.75,38.1
N$271  (via drill 0.76 pad 1.52)
  other vias: 37.21,38.1
N$272  (via drill 0.76 pad 1.52)
  other vias: 44.83,38.1
N$273  (via drill 0.76 pad 1.52)
  other vias: 42.29,38.1
N$274  (via drill 0.76 pad 1.52)
  other vias: 49.91,38.1
N$275  (via drill 0.76 pad 1.52)
  other vias: 47.37,38.1
N$276  (via drill 0.76 pad 1.52)
  other vias: 54.99,38.1
N$277  (via drill 0.76 pad 1.52)
  other vias: 52.45,38.1
N$278  (via drill 0.76 pad 1.52)
  other vias: 60.07,38.1
N$279  (via drill 0.76 pad 1.52)
  other vias: 57.53,38.1
N$280  (via drill 0.76 pad 1.52)
  other vias: 65.15,38.1
N$281  (via drill 0.76 pad 1.52)
  other vias: 62.61,38.1
N$282  (via drill 0.76 pad 1.52)
  other vias: 70.23,38.1
N$283  (via drill 0.76 pad 1.52)
  other vias: 67.69,38.1
N$284  (via drill 0.76 pad 1.52)
  other vias: 75.31,38.1
N$285  (via drill 0.76 pad 1.52)
  other vias: 72.77,38.1
N$286  (via drill 0.76 pad 1.52)
  other vias: 80.39,38.1
N$287  (via drill 0.76 pad 1.52)
  other vias: 77.85,38.1
N$288  (via drill 0.76 pad 1.52)
  other vias: 85.47,38.1
N$289  (via drill 0.76 pad 1.52)
  other vias: 82.93,38.1
N$290  (via drill 0.76 pad 1.52)
  other vias: 90.55,38.1
N$291  (via drill 0.76 pad 1.52)
  other vias: 93.09,38.1
N$292  (via drill 0.76 pad 1.52)
  other vias: 88.01,38.1
N$293  (via drill 0.76 pad 1.52)
  other vias: 21.97,38.1
N$294  (via drill 0.76 pad 1.52)
  other vias: 24.51,38.1
N$295  (via drill 0.76 pad 1.52)
  other vias: 27.05,38.1
N$296  (via drill 0.76 pad 1.52)
  other vias: 6.73,38.1
N$297  (via drill 0.76 pad 1.52)
  other vias: 9.27,38.1
N$298  (via drill 0.76 pad 1.52)
  other vias: 11.81,38.1
N$299  (via drill 0.76 pad 1.52)
  other vias: 14.35,38.1
N$300  (via drill 0.76 pad 1.52)
  other vias: 16.89,38.1
N$301  (via drill 0.76 pad 1.52)
  other vias: 34.67,40.64
N$302
  Bottom 0.254: PAD48.1 65.15,17.64 64.02,16.51 64.02,8.89 65.29,7.62 65.29,4.08 CN1.17
N$303
  Bottom 0.254: PAD49.1 67.69,17.64 66.56,16.51 66.56,8.89 67.83,7.62 67.83,4.08 CN1.15
N$304
  Bottom 0.254: PAD50.1 70.37,20.32 70.37,17.78 69.1,16.51 69.1,8.89 70.37,7.62 70.37,4.08 CN1.13
N$305  (via drill 0.76 pad 1.52)
  other vias: 32.13,40.64
N$306  (via drill 0.76 pad 1.52)
  other vias: 39.75,40.64
N$307  (via drill 0.76 pad 1.52)
  other vias: 37.21,40.64
N$308  (via drill 0.76 pad 1.52)
  other vias: 44.83,40.64
N$309  (via drill 0.76 pad 1.52)
  other vias: 42.29,40.64
N$310  (via drill 0.76 pad 1.52)
  other vias: 49.91,40.64
N$311  (via drill 0.76 pad 1.52)
  other vias: 47.37,40.64
N$312  (via drill 0.76 pad 1.52)
  other vias: 54.99,40.64
N$313  (via drill 0.76 pad 1.52)
  other vias: 52.45,40.64
N$314  (via drill 0.76 pad 1.52)
  other vias: 60.07,40.64
N$315  (via drill 0.76 pad 1.52)
  other vias: 57.53,40.64
N$316  (via drill 0.76 pad 1.52)
  other vias: 65.15,40.64
N$317  (via drill 0.76 pad 1.52)
  other vias: 62.61,40.64
N$318  (via drill 0.76 pad 1.52)
  other vias: 70.23,40.64
N$319  (via drill 0.76 pad 1.52)
  other vias: 67.69,40.64
N$320  (via drill 0.76 pad 1.52)
  other vias: 75.31,40.64
N$321  (via drill 0.76 pad 1.52)
  other vias: 72.77,40.64
N$322  (via drill 0.76 pad 1.52)
  other vias: 80.39,40.64
N$323  (via drill 0.76 pad 1.52)
  other vias: 77.85,40.64
N$324  (via drill 0.76 pad 1.52)
  other vias: 85.47,40.64
N$325  (via drill 0.76 pad 1.52)
  other vias: 82.93,40.64
N$326  (via drill 0.76 pad 1.52)
  other vias: 90.55,40.64
N$327  (via drill 0.76 pad 1.52)
  other vias: 93.09,40.64
N$328  (via drill 0.76 pad 1.52)
  other vias: 88.01,40.64
N$329  (via drill 0.76 pad 1.52)
  other vias: 21.97,40.64
N$330  (via drill 0.76 pad 1.52)
  other vias: 24.51,40.64
N$331  (via drill 0.76 pad 1.52)
  other vias: 27.05,40.64
N$332  (via drill 0.76 pad 1.52)
  other vias: 6.73,40.64
N$333  (via drill 0.76 pad 1.52)
  other vias: 9.27,40.64
N$334  (via drill 0.76 pad 1.52)
  other vias: 11.81,40.64
N$335  (via drill 0.76 pad 1.52)
  other vias: 14.35,40.64
N$336  (via drill 0.76 pad 1.52)
  other vias: 16.89,40.64
N$337  (via drill 0.76 pad 1.52)
  other vias: 34.67,43.18
N$338  (via drill 0.76 pad 1.52)
  other vias: 32.13,43.18
N$339  (via drill 0.76 pad 1.52)
  other vias: 39.75,43.18
N$340  (via drill 0.76 pad 1.52)
  other vias: 37.21,43.18
N$341  (via drill 0.76 pad 1.52)
  other vias: 44.83,43.18
N$342  (via drill 0.76 pad 1.52)
  other vias: 42.29,43.18
N$343  (via drill 0.76 pad 1.52)
  other vias: 49.91,43.18
N$344  (via drill 0.76 pad 1.52)
  other vias: 47.37,43.18
N$345  (via drill 0.76 pad 1.52)
  other vias: 54.99,43.18
N$346  (via drill 0.76 pad 1.52)
  other vias: 52.45,43.18
N$347  (via drill 0.76 pad 1.52)
  other vias: 60.07,43.18
N$348  (via drill 0.76 pad 1.52)
  other vias: 57.53,43.18
N$349  (via drill 0.76 pad 1.52)
  other vias: 65.15,43.18
N$350  (via drill 0.76 pad 1.52)
  other vias: 62.61,43.18
N$351  (via drill 0.76 pad 1.52)
  other vias: 70.23,43.18
N$352  (via drill 0.76 pad 1.52)
  other vias: 67.69,43.18
N$353  (via drill 0.76 pad 1.52)
  other vias: 75.31,43.18
N$354  (via drill 0.76 pad 1.52)
  other vias: 72.77,43.18
N$355  (via drill 0.76 pad 1.52)
  other vias: 80.39,43.18
N$356  (via drill 0.76 pad 1.52)
  other vias: 77.85,43.18
N$357  (via drill 0.76 pad 1.52)
  other vias: 85.47,43.18
N$358  (via drill 0.76 pad 1.52)
  other vias: 82.93,43.18
N$359  (via drill 0.76 pad 1.52)
  other vias: 90.55,43.18
N$360  (via drill 0.76 pad 1.52)
  other vias: 93.09,43.18
N$361  (via drill 0.76 pad 1.52)
  other vias: 88.01,43.18
N$362  (via drill 0.76 pad 1.52)
  other vias: 21.97,43.18
N$363  (via drill 0.76 pad 1.52)
  other vias: 24.51,43.18
N$364  (via drill 0.76 pad 1.52)
  other vias: 27.05,43.18
N$365  (via drill 0.76 pad 1.52)
  other vias: 6.73,43.18
N$366  (via drill 0.76 pad 1.52)
  other vias: 9.27,43.18
N$367  (via drill 0.76 pad 1.52)
  other vias: 11.81,43.18
N$368  (via drill 0.76 pad 1.52)
  other vias: 14.35,43.18
N$369  (via drill 0.76 pad 1.52)
  other vias: 16.89,43.18
N$370  (via drill 0.76 pad 1.52)
  other vias: 34.67,45.72
N$371  (via drill 0.76 pad 1.52)
  other vias: 32.13,45.72
N$372  (via drill 0.76 pad 1.52)
  other vias: 39.75,45.72
N$373  (via drill 0.76 pad 1.52)
  other vias: 37.21,45.72
N$374  (via drill 0.76 pad 1.52)
  other vias: 44.83,45.72
N$375  (via drill 0.76 pad 1.52)
  other vias: 42.29,45.72
N$376  (via drill 0.76 pad 1.52)
  other vias: 49.91,45.72
N$377  (via drill 0.76 pad 1.52)
  other vias: 47.37,45.72
N$378  (via drill 0.76 pad 1.52)
  other vias: 54.99,45.72
N$379  (via drill 0.76 pad 1.52)
  other vias: 52.45,45.72
N$380  (via drill 0.76 pad 1.52)
  other vias: 60.07,45.72
N$381  (via drill 0.76 pad 1.52)
  other vias: 57.53,45.72
N$382  (via drill 0.76 pad 1.52)
  other vias: 65.15,45.72
N$383  (via drill 0.76 pad 1.52)
  other vias: 62.61,45.72
N$384  (via drill 0.76 pad 1.52)
  other vias: 70.23,45.72
N$385  (via drill 0.76 pad 1.52)
  other vias: 67.69,45.72
N$386  (via drill 0.76 pad 1.52)
  other vias: 75.31,45.72
N$387  (via drill 0.76 pad 1.52)
  other vias: 72.77,45.72
N$388  (via drill 0.76 pad 1.52)
  other vias: 80.39,45.72
N$389  (via drill 0.76 pad 1.52)
  other vias: 77.85,45.72
N$390  (via drill 0.76 pad 1.52)
  other vias: 85.47,45.72
N$391  (via drill 0.76 pad 1.52)
  other vias: 82.93,45.72
N$392  (via drill 0.76 pad 1.52)
  other vias: 90.55,45.72
N$393  (via drill 0.76 pad 1.52)
  other vias: 93.09,45.72
N$394  (via drill 0.76 pad 1.52)
  other vias: 88.01,45.72
N$395  (via drill 0.76 pad 1.52)
  other vias: 21.97,45.72
N$396  (via drill 0.76 pad 1.52)
  other vias: 24.51,45.72
N$397  (via drill 0.76 pad 1.52)
  other vias: 27.05,45.72
N$398  (via drill 0.76 pad 1.52)
  other vias: 6.73,45.72
N$399  (via drill 0.76 pad 1.52)
  other vias: 9.27,45.72
N$400  (via drill 0.76 pad 1.52)
  other vias: 11.81,45.72
N$401  (via drill 0.76 pad 1.52)
  other vias: 14.35,45.72
N$402  (via drill 0.76 pad 1.52)
  other vias: 16.89,45.72
N$403  (via drill 0.76 pad 1.52)
  other vias: 34.67,48.26
N$404  (via drill 0.76 pad 1.52)
  other vias: 32.13,48.26
N$405  (via drill 0.76 pad 1.52)
  other vias: 39.75,48.26
N$406  (via drill 0.76 pad 1.52)
  other vias: 37.21,48.26
N$407  (via drill 0.76 pad 1.52)
  other vias: 44.83,48.26
N$408  (via drill 0.76 pad 1.52)
  other vias: 42.29,48.26
N$409  (via drill 0.76 pad 1.52)
  other vias: 49.91,48.26
N$410  (via drill 0.76 pad 1.52)
  other vias: 47.37,48.26
N$411  (via drill 0.76 pad 1.52)
  other vias: 54.99,48.26
N$412  (via drill 0.76 pad 1.52)
  other vias: 52.45,48.26
N$413  (via drill 0.76 pad 1.52)
  other vias: 60.07,48.26
N$414  (via drill 0.76 pad 1.52)
  other vias: 57.53,48.26
N$415  (via drill 0.76 pad 1.52)
  other vias: 65.15,48.26
N$416  (via drill 0.76 pad 1.52)
  other vias: 62.61,48.26
N$417  (via drill 0.76 pad 1.52)
  other vias: 70.23,48.26
N$418  (via drill 0.76 pad 1.52)
  other vias: 67.69,48.26
N$419  (via drill 0.76 pad 1.52)
  other vias: 75.31,48.26
N$420  (via drill 0.76 pad 1.52)
  other vias: 72.77,48.26
N$421  (via drill 0.76 pad 1.52)
  other vias: 80.39,48.26
N$422  (via drill 0.76 pad 1.52)
  other vias: 77.85,48.26
N$423  (via drill 0.76 pad 1.52)
  other vias: 85.47,48.26
N$424  (via drill 0.76 pad 1.52)
  other vias: 82.93,48.26
N$425  (via drill 0.76 pad 1.52)
  other vias: 90.55,48.26
N$426  (via drill 0.76 pad 1.52)
  other vias: 93.09,48.26
N$427  (via drill 0.76 pad 1.52)
  other vias: 88.01,48.26
N$428  (via drill 0.76 pad 1.52)
  other vias: 21.97,48.26
N$429  (via drill 0.76 pad 1.52)
  other vias: 24.51,48.26
N$430  (via drill 0.76 pad 1.52)
  other vias: 27.05,48.26
N$431  (via drill 0.76 pad 1.52)
  other vias: 6.73,48.26
N$432  (via drill 0.76 pad 1.52)
  other vias: 9.27,48.26
N$433  (via drill 0.76 pad 1.52)
  other vias: 11.81,48.26
N$434  (via drill 0.76 pad 1.52)
  other vias: 14.35,48.26
N$435  (via drill 0.76 pad 1.52)
  other vias: 16.89,48.26
N$436  (via drill 0.76 pad 1.52)
  other vias: 34.67,50.8
N$437  (via drill 0.76 pad 1.52)
  other vias: 32.13,50.8
N$438  (via drill 0.76 pad 1.52)
  other vias: 39.75,50.8
N$439  (via drill 0.76 pad 1.52)
  other vias: 37.21,50.8
N$440  (via drill 0.76 pad 1.52)
  other vias: 44.83,50.8
N$441  (via drill 0.76 pad 1.52)
  other vias: 42.29,50.8
N$442  (via drill 0.76 pad 1.52)
  other vias: 49.91,50.8
N$443  (via drill 0.76 pad 1.52)
  other vias: 47.37,50.8
N$444  (via drill 0.76 pad 1.52)
  other vias: 54.99,50.8
N$445  (via drill 0.76 pad 1.52)
  other vias: 52.45,50.8
N$446  (via drill 0.76 pad 1.52)
  other vias: 60.07,50.8
N$447  (via drill 0.76 pad 1.52)
  other vias: 57.53,50.8
N$448  (via drill 0.76 pad 1.52)
  other vias: 65.15,50.8
N$449  (via drill 0.76 pad 1.52)
  other vias: 62.61,50.8
N$450  (via drill 0.76 pad 1.52)
  other vias: 70.23,50.8
N$451  (via drill 0.76 pad 1.52)
  other vias: 67.69,50.8
N$452  (via drill 0.76 pad 1.52)
  other vias: 75.31,50.8
N$453  (via drill 0.76 pad 1.52)
  other vias: 72.77,50.8
N$454  (via drill 0.76 pad 1.52)
  other vias: 80.39,50.8
N$455  (via drill 0.76 pad 1.52)
  other vias: 77.85,50.8
N$456  (via drill 0.76 pad 1.52)
  other vias: 85.47,50.8
N$457  (via drill 0.76 pad 1.52)
  other vias: 82.93,50.8
N$458  (via drill 0.76 pad 1.52)
  other vias: 90.55,50.8
N$459  (via drill 0.76 pad 1.52)
  other vias: 93.09,50.8
N$460  (via drill 0.76 pad 1.52)
  other vias: 88.01,50.8
N$461  (via drill 0.76 pad 1.52)
  other vias: 21.97,50.8
N$462  (via drill 0.76 pad 1.52)
  other vias: 24.51,50.8
N$463  (via drill 0.76 pad 1.52)
  other vias: 27.05,50.8
N$464  (via drill 0.76 pad 1.52)
  other vias: 6.73,50.8
N$465  (via drill 0.76 pad 1.52)
  other vias: 9.27,50.8
N$466  (via drill 0.76 pad 1.52)
  other vias: 11.81,50.8
N$467  (via drill 0.76 pad 1.52)
  other vias: 14.35,50.8
N$468  (via drill 0.76 pad 1.52)
  other vias: 16.89,50.8
N$469  (via drill 0.76 pad 1.52)
  other vias: 34.67,53.34
N$470  (via drill 0.76 pad 1.52)
  other vias: 32.13,53.34
N$471  (via drill 0.76 pad 1.52)
  other vias: 39.75,53.34
N$472  (via drill 0.76 pad 1.52)
  other vias: 37.21,53.34
N$473  (via drill 0.76 pad 1.52)
  other vias: 44.83,53.34
N$474  (via drill 0.76 pad 1.52)
  other vias: 42.29,53.34
N$475  (via drill 0.76 pad 1.52)
  other vias: 49.91,53.34
N$476  (via drill 0.76 pad 1.52)
  other vias: 47.37,53.34
N$477  (via drill 0.76 pad 1.52)
  other vias: 54.99,53.34
N$478  (via drill 0.76 pad 1.52)
  other vias: 52.45,53.34
N$479  (via drill 0.76 pad 1.52)
  other vias: 60.07,53.34
N$480  (via drill 0.76 pad 1.52)
  other vias: 57.53,53.34
N$481  (via drill 0.76 pad 1.52)
  other vias: 65.15,53.34
N$482  (via drill 0.76 pad 1.52)
  other vias: 62.61,53.34
N$483  (via drill 0.76 pad 1.52)
  other vias: 70.23,53.34
N$484  (via drill 0.76 pad 1.52)
  other vias: 67.69,53.34
N$485  (via drill 0.76 pad 1.52)
  other vias: 75.31,53.34
N$486  (via drill 0.76 pad 1.52)
  other vias: 72.77,53.34
N$487  (via drill 0.76 pad 1.52)
  other vias: 80.39,53.34
N$488  (via drill 0.76 pad 1.52)
  other vias: 77.85,53.34
N$489  (via drill 0.76 pad 1.52)
  other vias: 85.47,53.34
N$490  (via drill 0.76 pad 1.52)
  other vias: 82.93,53.34
N$491  (via drill 0.76 pad 1.52)
  other vias: 90.55,53.34
N$492  (via drill 0.76 pad 1.52)
  other vias: 93.09,53.34
N$493  (via drill 0.76 pad 1.52)
  other vias: 88.01,53.34
N$494  (via drill 0.76 pad 1.52)
  other vias: 21.97,53.34
N$495  (via drill 0.76 pad 1.52)
  other vias: 24.51,53.34
N$496  (via drill 0.76 pad 1.52)
  other vias: 27.05,53.34
N$497  (via drill 0.76 pad 1.52)
  other vias: 6.73,53.34
N$498  (via drill 0.76 pad 1.52)
  other vias: 9.27,53.34
N$499  (via drill 0.76 pad 1.52)
  other vias: 11.81,53.34
N$500  (via drill 0.76 pad 1.52)
  other vias: 14.35,53.34
N$501  (via drill 0.76 pad 1.52)
  other vias: 16.89,53.34
N$502  (via drill 0.76 pad 1.52)
  other vias: 34.67,55.88
N$503  (via drill 0.76 pad 1.52)
  other vias: 32.13,55.88
N$504  (via drill 0.76 pad 1.52)
  other vias: 39.75,55.88
N$505  (via drill 0.76 pad 1.52)
  other vias: 37.21,55.88
N$506  (via drill 0.76 pad 1.52)
  other vias: 44.83,55.88
N$507  (via drill 0.76 pad 1.52)
  other vias: 42.29,55.88
N$508  (via drill 0.76 pad 1.52)
  other vias: 49.91,55.88
N$509  (via drill 0.76 pad 1.52)
  other vias: 47.37,55.88
N$510  (via drill 0.76 pad 1.52)
  other vias: 54.99,55.88
N$511  (via drill 0.76 pad 1.52)
  other vias: 52.45,55.88
N$512  (via drill 0.76 pad 1.52)
  other vias: 60.07,55.88
N$513  (via drill 0.76 pad 1.52)
  other vias: 57.53,55.88
N$514  (via drill 0.76 pad 1.52)
  other vias: 65.15,55.88
N$515  (via drill 0.76 pad 1.52)
  other vias: 62.61,55.88
N$516  (via drill 0.76 pad 1.52)
  other vias: 70.23,55.88
N$517  (via drill 0.76 pad 1.52)
  other vias: 67.69,55.88
N$518  (via drill 0.76 pad 1.52)
  other vias: 75.31,55.88
N$519  (via drill 0.76 pad 1.52)
  other vias: 72.77,55.88
N$520  (via drill 0.76 pad 1.52)
  other vias: 80.39,55.88
N$521  (via drill 0.76 pad 1.52)
  other vias: 77.85,55.88
N$522  (via drill 0.76 pad 1.52)
  other vias: 85.47,55.88
N$523  (via drill 0.76 pad 1.52)
  other vias: 82.93,55.88
N$524  (via drill 0.76 pad 1.52)
  other vias: 90.55,55.88
N$525  (via drill 0.76 pad 1.52)
  other vias: 93.09,55.88
N$526  (via drill 0.76 pad 1.52)
  other vias: 88.01,55.88
N$527  (via drill 0.76 pad 1.52)
  other vias: 21.97,55.88
N$528  (via drill 0.76 pad 1.52)
  other vias: 24.51,55.88
N$529  (via drill 0.76 pad 1.52)
  other vias: 27.05,55.88
N$530  (via drill 0.76 pad 1.52)
  other vias: 6.73,55.88
N$531  (via drill 0.76 pad 1.52)
  other vias: 9.27,55.88
N$532  (via drill 0.76 pad 1.52)
  other vias: 11.81,55.88
N$533  (via drill 0.76 pad 1.52)
  other vias: 14.35,55.88
N$534  (via drill 0.76 pad 1.52)
  other vias: 16.89,55.88
N$535  (via drill 0.76 pad 1.52)
  other vias: 34.67,58.42
N$536  (via drill 0.76 pad 1.52)
  other vias: 32.13,58.42
N$537  (via drill 0.76 pad 1.52)
  other vias: 39.75,58.42
N$538  (via drill 0.76 pad 1.52)
  other vias: 37.21,58.42
N$539  (via drill 0.76 pad 1.52)
  other vias: 44.83,58.42
N$540  (via drill 0.76 pad 1.52)
  other vias: 42.29,58.42
N$541  (via drill 0.76 pad 1.52)
  other vias: 49.91,58.42
N$542  (via drill 0.76 pad 1.52)
  other vias: 47.37,58.42
N$543  (via drill 0.76 pad 1.52)
  other vias: 54.99,58.42
N$544  (via drill 0.76 pad 1.52)
  other vias: 52.45,58.42
N$545  (via drill 0.76 pad 1.52)
  other vias: 60.07,58.42
N$546  (via drill 0.76 pad 1.52)
  other vias: 57.53,58.42
N$547  (via drill 0.76 pad 1.52)
  other vias: 65.15,58.42
N$548  (via drill 0.76 pad 1.52)
  other vias: 62.61,58.42
N$549  (via drill 0.76 pad 1.52)
  other vias: 70.23,58.42
N$550  (via drill 0.76 pad 1.52)
  other vias: 67.69,58.42
N$551  (via drill 0.76 pad 1.52)
  other vias: 75.31,58.42
N$552  (via drill 0.76 pad 1.52)
  other vias: 72.77,58.42
N$553  (via drill 0.76 pad 1.52)
  other vias: 80.39,58.42
N$554  (via drill 0.76 pad 1.52)
  other vias: 77.85,58.42
N$555  (via drill 0.76 pad 1.52)
  other vias: 85.47,58.42
N$556  (via drill 0.76 pad 1.52)
  other vias: 82.93,58.42
N$557  (via drill 0.76 pad 1.52)
  other vias: 90.55,58.42
N$558  (via drill 0.76 pad 1.52)
  other vias: 93.09,58.42
N$559  (via drill 0.76 pad 1.52)
  other vias: 88.01,58.42
N$560  (via drill 0.76 pad 1.52)
  other vias: 21.97,58.42
N$561  (via drill 0.76 pad 1.52)
  other vias: 24.51,58.42
N$562  (via drill 0.76 pad 1.52)
  other vias: 27.05,58.42
N$563  (via drill 0.76 pad 1.52)
  other vias: 6.73,58.42
N$564  (via drill 0.76 pad 1.52)
  other vias: 9.27,58.42
N$565  (via drill 0.76 pad 1.52)
  other vias: 11.81,58.42
N$566  (via drill 0.76 pad 1.52)
  other vias: 14.35,58.42
N$567  (via drill 0.76 pad 1.52)
  other vias: 16.89,58.42
N$568  (via drill 0.76 pad 1.52)
  other vias: 34.67,60.96
N$569  (via drill 0.76 pad 1.52)
  other vias: 32.13,60.96
N$570  (via drill 0.76 pad 1.52)
  other vias: 39.75,60.96
N$571  (via drill 0.76 pad 1.52)
  other vias: 37.21,60.96
N$572  (via drill 0.76 pad 1.52)
  other vias: 44.83,60.96
N$573  (via drill 0.76 pad 1.52)
  other vias: 42.29,60.96
N$574  (via drill 0.76 pad 1.52)
  other vias: 49.91,60.96
N$575  (via drill 0.76 pad 1.52)
  other vias: 47.37,60.96
N$576  (via drill 0.76 pad 1.52)
  other vias: 54.99,60.96
N$577  (via drill 0.76 pad 1.52)
  other vias: 52.45,60.96
N$578  (via drill 0.76 pad 1.52)
  other vias: 60.07,60.96
N$579  (via drill 0.76 pad 1.52)
  other vias: 57.53,60.96
N$580  (via drill 0.76 pad 1.52)
  other vias: 65.15,60.96
N$581  (via drill 0.76 pad 1.52)
  other vias: 62.61,60.96
N$582  (via drill 0.76 pad 1.52)
  other vias: 70.23,60.96
N$583  (via drill 0.76 pad 1.52)
  other vias: 67.69,60.96
N$584  (via drill 0.76 pad 1.52)
  other vias: 75.31,60.96
N$585  (via drill 0.76 pad 1.52)
  other vias: 72.77,60.96
N$586  (via drill 0.76 pad 1.52)
  other vias: 80.39,60.96
N$587  (via drill 0.76 pad 1.52)
  other vias: 77.85,60.96
N$588  (via drill 0.76 pad 1.52)
  other vias: 85.47,60.96
N$589  (via drill 0.76 pad 1.52)
  other vias: 82.93,60.96
N$590  (via drill 0.76 pad 1.52)
  other vias: 90.55,60.96
N$591  (via drill 0.76 pad 1.52)
  other vias: 93.09,60.96
N$592  (via drill 0.76 pad 1.52)
  other vias: 88.01,60.96
N$593  (via drill 0.76 pad 1.52)
  other vias: 21.97,60.96
N$594  (via drill 0.76 pad 1.52)
  other vias: 24.51,60.96
N$595  (via drill 0.76 pad 1.52)
  other vias: 27.05,60.96
N$596  (via drill 0.76 pad 1.52)
  other vias: 6.73,60.96
N$597  (via drill 0.76 pad 1.52)
  other vias: 9.27,60.96
N$598  (via drill 0.76 pad 1.52)
  other vias: 11.81,60.96
N$599  (via drill 0.76 pad 1.52)
  other vias: 14.35,60.96
N$600  (via drill 0.76 pad 1.52)
  other vias: 16.89,60.96
N$601  (via drill 0.76 pad 1.52)
  other vias: 34.67,63.5
N$602  (via drill 0.76 pad 1.52)
  other vias: 32.13,63.5
N$603  (via drill 0.76 pad 1.52)
  other vias: 39.75,63.5
N$604  (via drill 0.76 pad 1.52)
  other vias: 37.21,63.5
N$605  (via drill 0.76 pad 1.52)
  other vias: 44.83,63.5
N$606  (via drill 0.76 pad 1.52)
  other vias: 42.29,63.5
N$607  (via drill 0.76 pad 1.52)
  other vias: 49.91,63.5
N$608  (via drill 0.76 pad 1.52)
  other vias: 47.37,63.5
N$609  (via drill 0.76 pad 1.52)
  other vias: 54.99,63.5
N$610  (via drill 0.76 pad 1.52)
  other vias: 52.45,63.5
N$611  (via drill 0.76 pad 1.52)
  other vias: 60.07,63.5
N$612  (via drill 0.76 pad 1.52)
  other vias: 57.53,63.5
N$613  (via drill 0.76 pad 1.52)
  other vias: 65.15,63.5
N$614  (via drill 0.76 pad 1.52)
  other vias: 62.61,63.5
N$615  (via drill 0.76 pad 1.52)
  other vias: 70.23,63.5
N$616  (via drill 0.76 pad 1.52)
  other vias: 67.69,63.5
N$617  (via drill 0.76 pad 1.52)
  other vias: 75.31,63.5
N$618  (via drill 0.76 pad 1.52)
  other vias: 72.77,63.5
N$619  (via drill 0.76 pad 1.52)
  other vias: 80.39,63.5
N$620  (via drill 0.76 pad 1.52)
  other vias: 77.85,63.5
N$621  (via drill 0.76 pad 1.52)
  other vias: 85.47,63.5
N$622  (via drill 0.76 pad 1.52)
  other vias: 82.93,63.5
N$623  (via drill 0.76 pad 1.52)
  other vias: 90.55,63.5
N$624  (via drill 0.76 pad 1.52)
  other vias: 93.09,63.5
N$625  (via drill 0.76 pad 1.52)
  other vias: 88.01,63.5
N$626  (via drill 0.76 pad 1.52)
  other vias: 21.97,63.5
N$627  (via drill 0.76 pad 1.52)
  other vias: 24.51,63.5
N$628  (via drill 0.76 pad 1.52)
  other vias: 27.05,63.5
N$629  (via drill 0.76 pad 1.52)
  other vias: 6.73,63.5
N$630  (via drill 0.76 pad 1.52)
  other vias: 9.27,63.5
N$631  (via drill 0.76 pad 1.52)
  other vias: 11.81,63.5
N$632  (via drill 0.76 pad 1.52)
  other vias: 14.35,63.5
N$633  (via drill 0.76 pad 1.52)
  other vias: 16.89,63.5
N$634  (via drill 0.76 pad 1.52)
  other vias: 34.67,66.04
N$635  (via drill 0.76 pad 1.52)
  other vias: 32.13,66.04
N$636  (via drill 0.76 pad 1.52)
  other vias: 39.75,66.04
N$637  (via drill 0.76 pad 1.52)
  other vias: 37.21,66.04
N$638  (via drill 0.76 pad 1.52)
  other vias: 44.83,66.04
N$639  (via drill 0.76 pad 1.52)
  other vias: 42.29,66.04
N$640  (via drill 0.76 pad 1.52)
  other vias: 49.91,66.04
N$641  (via drill 0.76 pad 1.52)
  other vias: 47.37,66.04
N$642  (via drill 0.76 pad 1.52)
  other vias: 54.99,66.04
N$643  (via drill 0.76 pad 1.52)
  other vias: 52.45,66.04
N$644  (via drill 0.76 pad 1.52)
  other vias: 60.07,66.04
N$645  (via drill 0.76 pad 1.52)
  other vias: 57.53,66.04
N$646  (via drill 0.76 pad 1.52)
  other vias: 65.15,66.04
N$647  (via drill 0.76 pad 1.52)
  other vias: 62.61,66.04
N$648  (via drill 0.76 pad 1.52)
  other vias: 70.23,66.04
N$649  (via drill 0.76 pad 1.52)
  other vias: 67.69,66.04
N$650  (via drill 0.76 pad 1.52)
  other vias: 75.31,66.04
N$651  (via drill 0.76 pad 1.52)
  other vias: 72.77,66.04
N$652  (via drill 0.76 pad 1.52)
  other vias: 80.39,66.04
N$653  (via drill 0.76 pad 1.52)
  other vias: 77.85,66.04
N$654  (via drill 0.76 pad 1.52)
  other vias: 85.47,66.04
N$655  (via drill 0.76 pad 1.52)
  other vias: 82.93,66.04
N$656  (via drill 0.76 pad 1.52)
  other vias: 90.55,66.04
N$657  (via drill 0.76 pad 1.52)
  other vias: 93.09,66.04
N$658  (via drill 0.76 pad 1.52)
  other vias: 88.01,66.04
N$659  (via drill 0.76 pad 1.52)
  other vias: 21.97,66.04
N$660  (via drill 0.76 pad 1.52)
  other vias: 24.51,66.04
N$661  (via drill 0.76 pad 1.52)
  other vias: 27.05,66.04
N$662  (via drill 0.76 pad 1.52)
  other vias: 6.73,66.04
N$663  (via drill 0.76 pad 1.52)
  other vias: 9.27,66.04
N$664  (via drill 0.76 pad 1.52)
  other vias: 11.81,66.04
N$665  (via drill 0.76 pad 1.52)
  other vias: 14.35,66.04
N$666  (via drill 0.76 pad 1.52)
  other vias: 16.89,66.04
N$667  (via drill 0.76 pad 1.52)
  other vias: 34.67,68.58
N$668  (via drill 0.76 pad 1.52)
  other vias: 32.13,68.58
N$669  (via drill 0.76 pad 1.52)
  other vias: 39.75,68.58
N$670  (via drill 0.76 pad 1.52)
  other vias: 37.21,68.58
N$671  (via drill 0.76 pad 1.52)
  other vias: 44.83,68.58
N$672  (via drill 0.76 pad 1.52)
  other vias: 42.29,68.58
N$673  (via drill 0.76 pad 1.52)
  other vias: 49.91,68.58
N$674  (via drill 0.76 pad 1.52)
  other vias: 47.37,68.58
N$675  (via drill 0.76 pad 1.52)
  other vias: 54.99,68.58
N$676  (via drill 0.76 pad 1.52)
  other vias: 52.45,68.58
N$677  (via drill 0.76 pad 1.52)
  other vias: 60.07,68.58
N$678  (via drill 0.76 pad 1.52)
  other vias: 57.53,68.58
N$679  (via drill 0.76 pad 1.52)
  other vias: 65.15,68.58
N$680  (via drill 0.76 pad 1.52)
  other vias: 62.61,68.58
N$681  (via drill 0.76 pad 1.52)
  other vias: 70.23,68.58
N$682  (via drill 0.76 pad 1.52)
  other vias: 67.69,68.58
N$683  (via drill 0.76 pad 1.52)
  other vias: 75.31,68.58